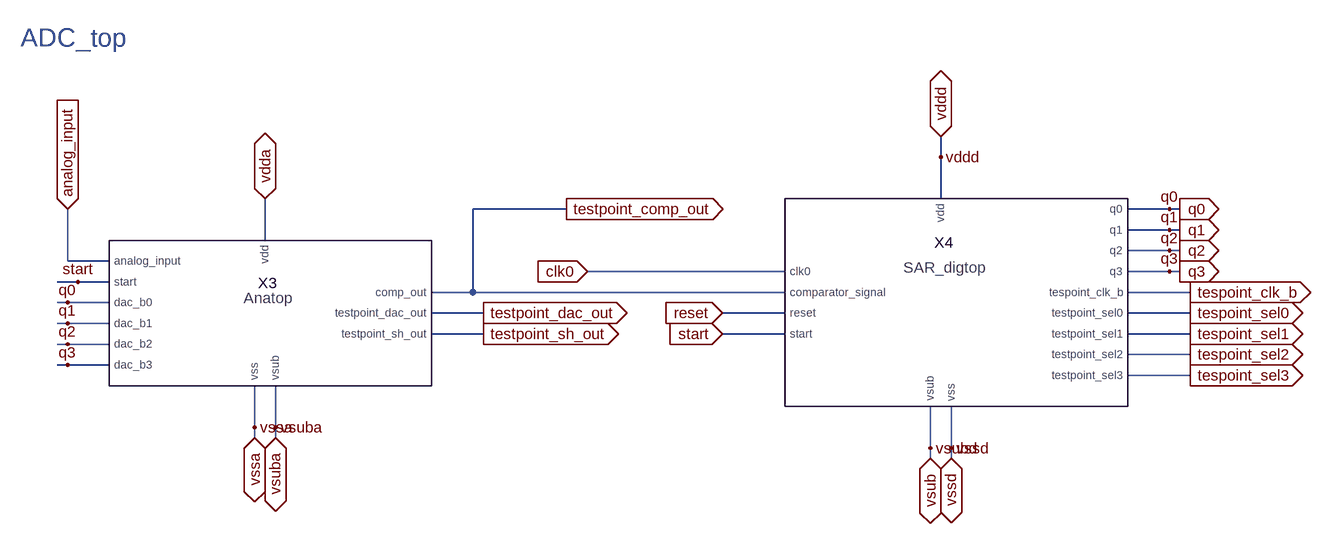
[diagram p0: schematic dsproj_adctop.asc]
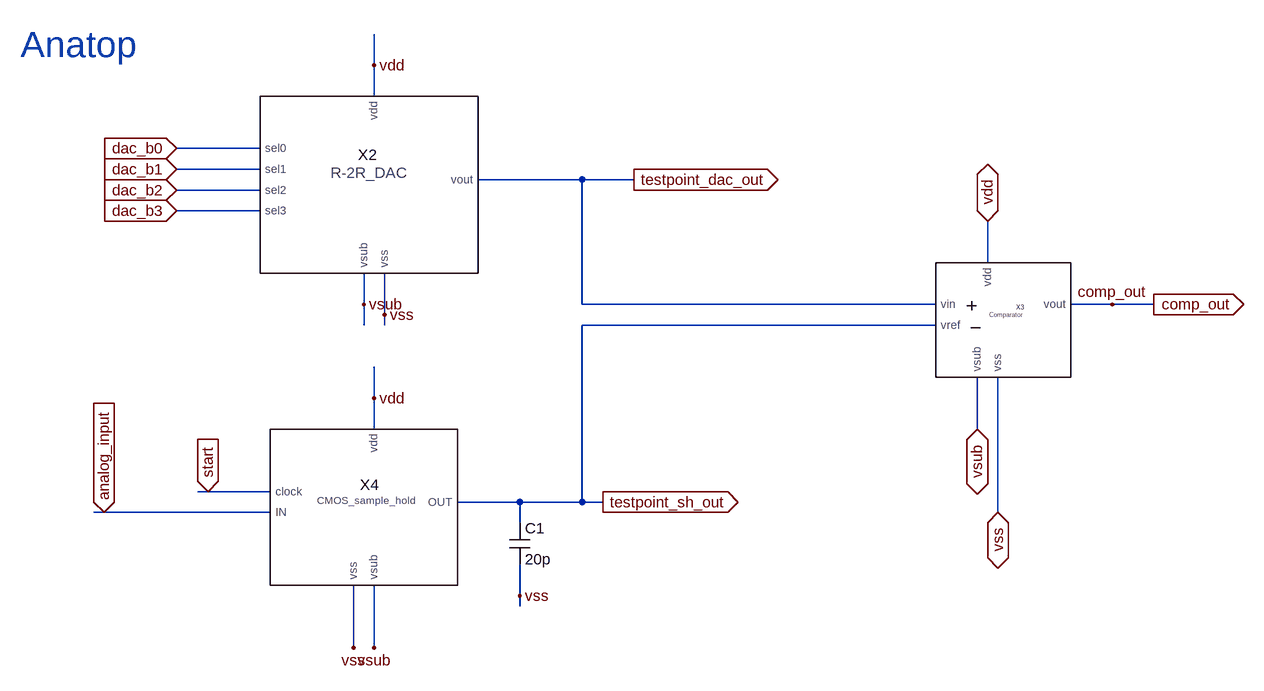
[diagram p1: sub-circuit dsproj_anatop.asc]
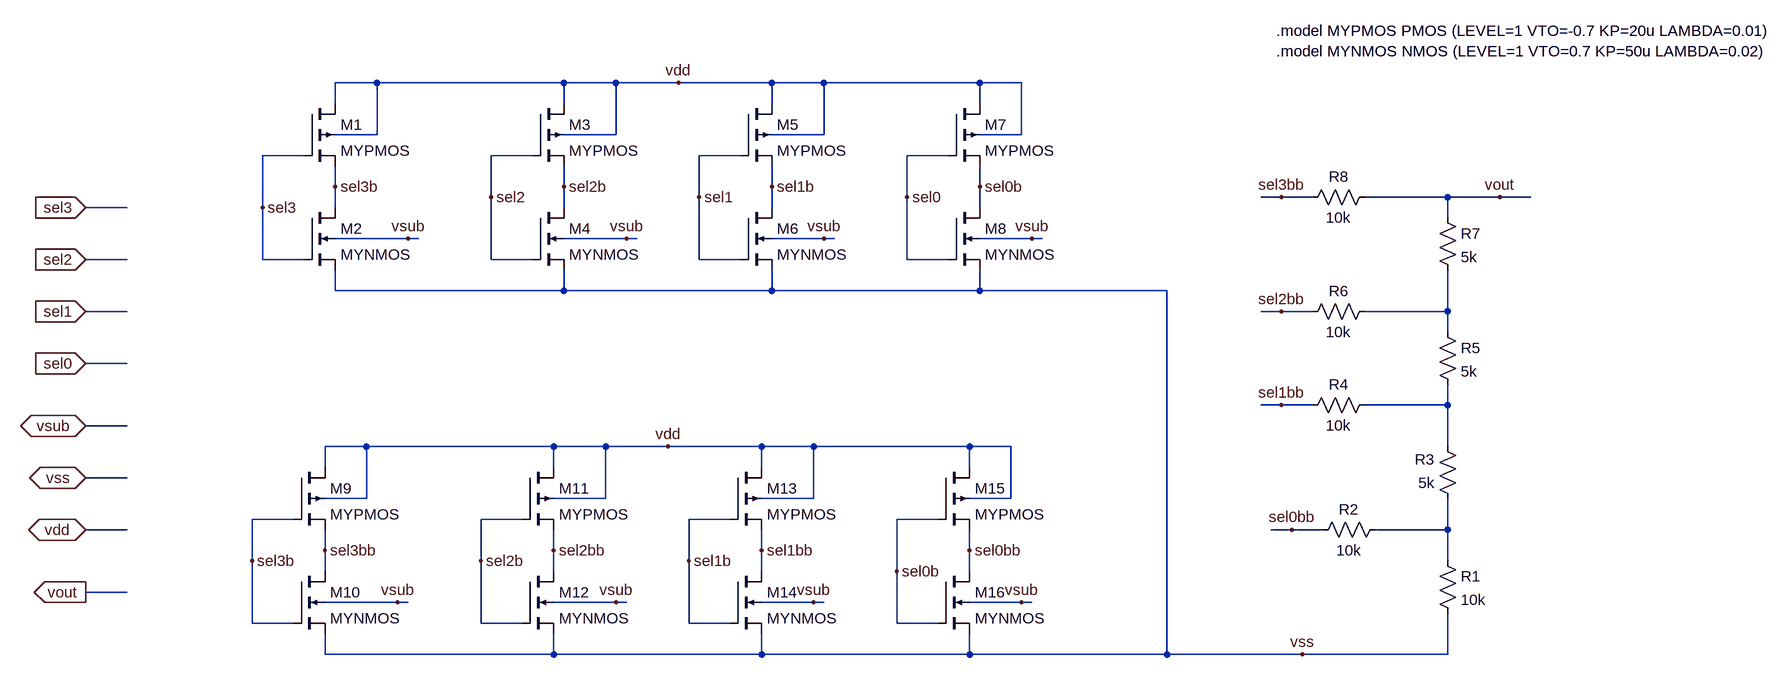
[diagram p2: sub-circuit dsproj_r2rdac.asc]
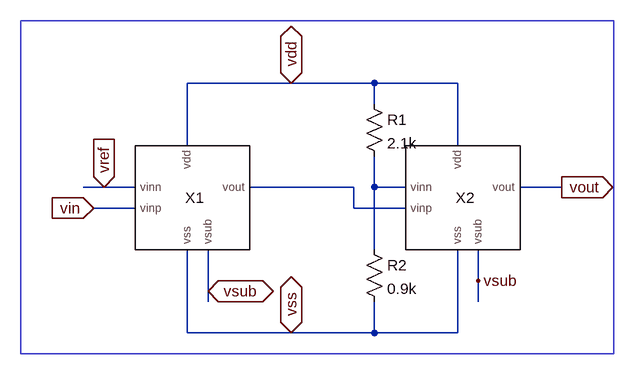
[diagram p3: sub-circuit dsproj_twostagecomparator.asc]
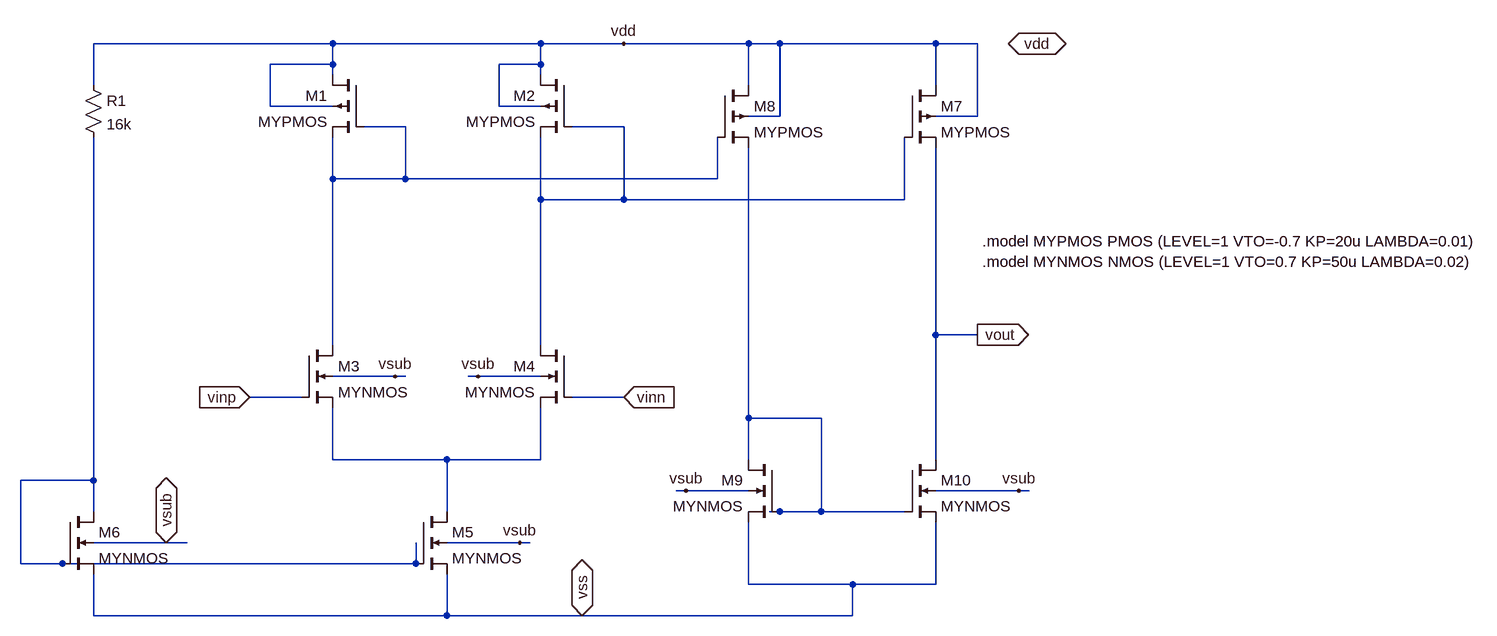
[diagram p4: sub-circuit dsproj_nmos_comparator.asc]
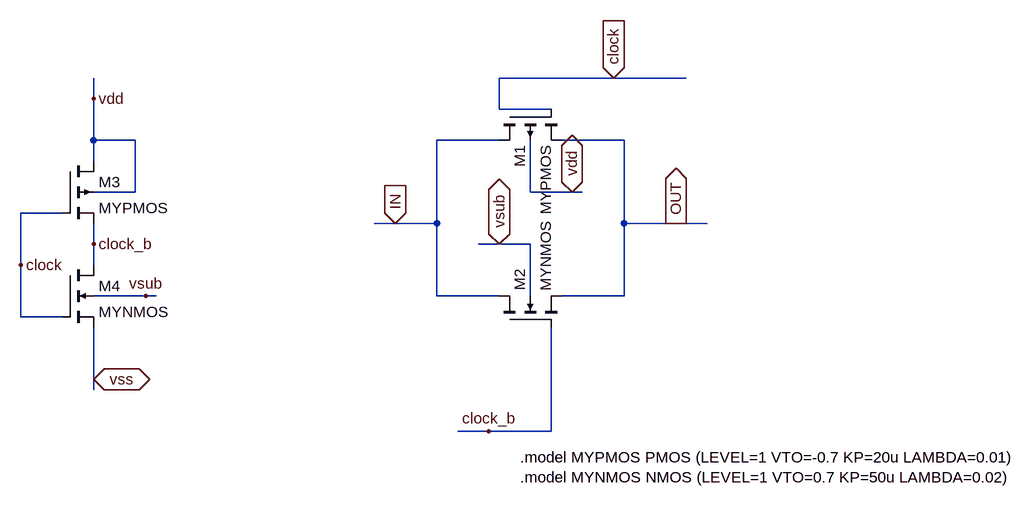
[diagram p5: sub-circuit dsproj_cmossampleandhold.asc]
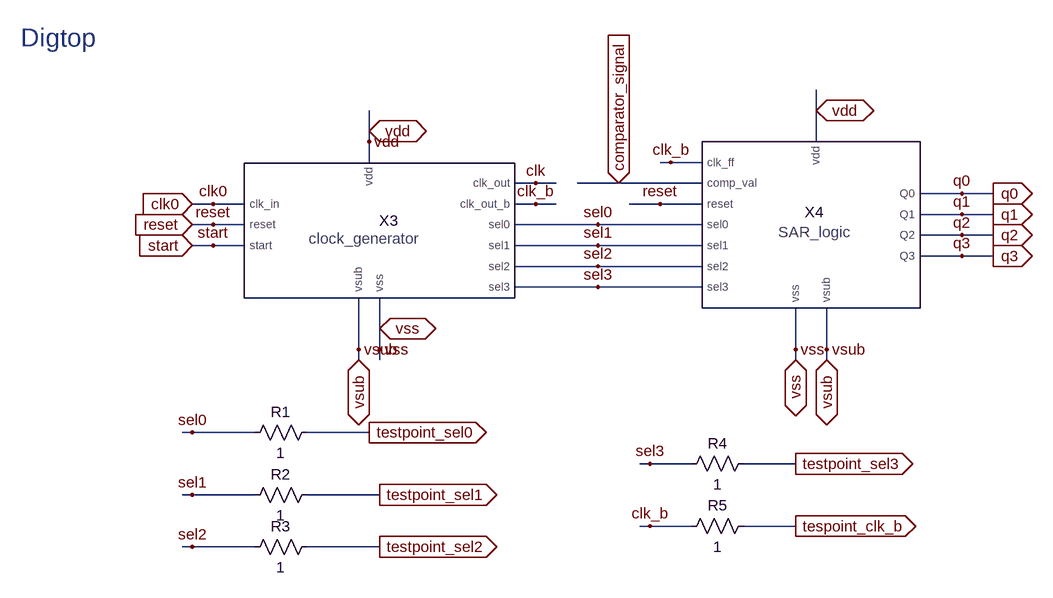
[diagram p6: sub-circuit dsproj_digtop.asc]
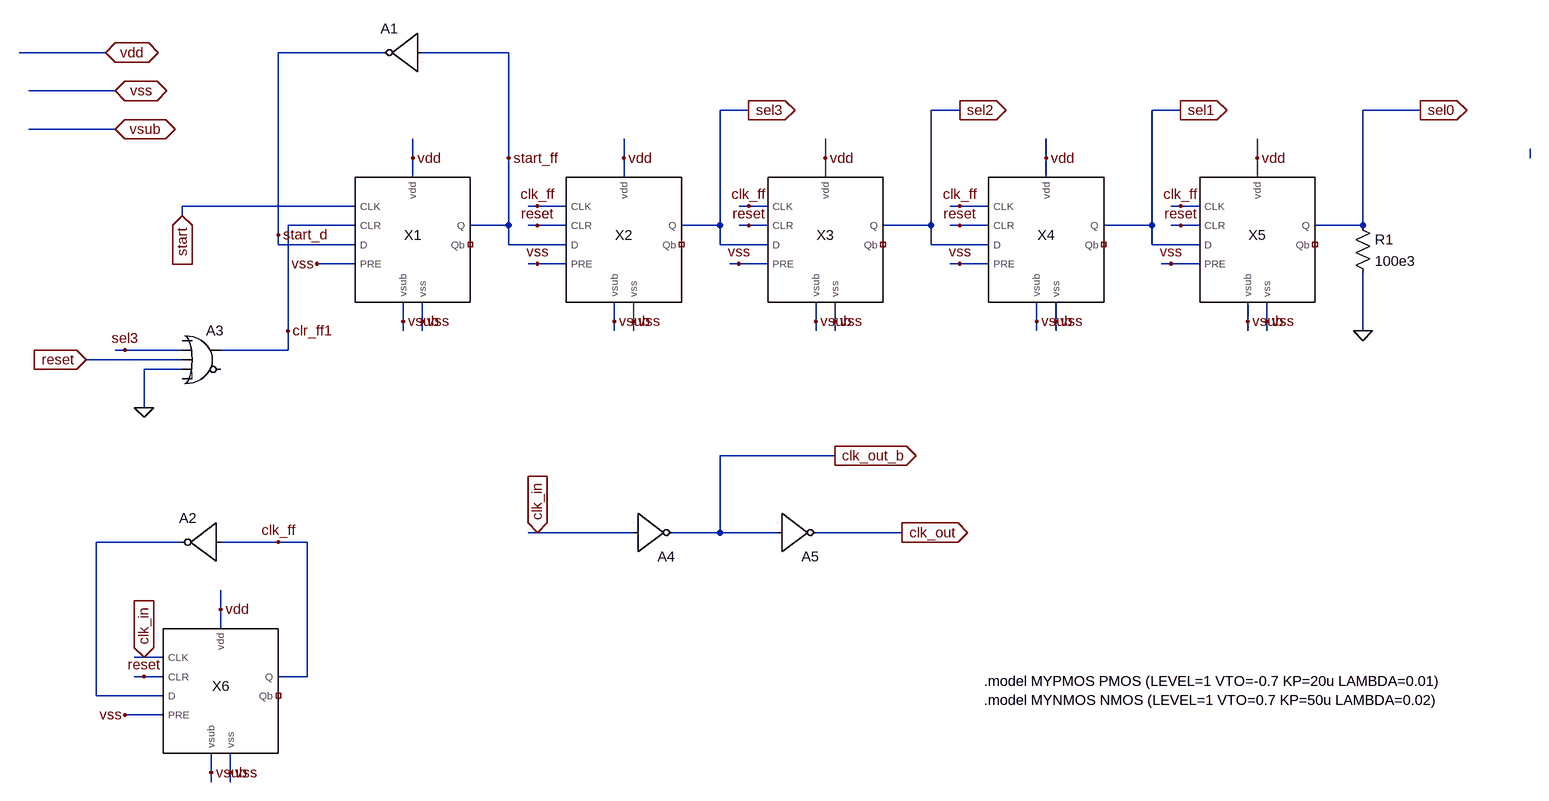
[diagram p7: sub-circuit dsproj_clkgenerator.asc]
dsproj_adctop.asc, the LTspice schematic file:
Version 4.1
SHEET 1 2052 900
WIRE 624 -208 624 -240
WIRE 624 -144 624 -208
WIRE 48 -128 -96 -128
WIRE 976 -128 912 -128
WIRE 992 -128 976 -128
WIRE 976 -96 912 -96
WIRE 992 -96 976 -96
WIRE -416 -80 -416 -144
WIRE 976 -64 912 -64
WIRE 992 -64 976 -64
WIRE -720 -48 -720 -128
WIRE -656 -48 -720 -48
WIRE 384 -32 80 -32
WIRE 976 -32 912 -32
WIRE 992 -32 976 -32
WIRE -704 -16 -736 -16
WIRE -656 -16 -704 -16
WIRE -96 0 -96 -128
WIRE -96 0 -160 0
WIRE 384 0 -96 0
WIRE 1008 0 912 0
WIRE -720 16 -736 16
WIRE -656 16 -720 16
WIRE -80 32 -160 32
WIRE 384 32 288 32
WIRE 1008 32 912 32
WIRE -720 48 -736 48
WIRE -656 48 -720 48
WIRE -80 64 -160 64
WIRE 384 64 288 64
WIRE 1008 64 912 64
WIRE -720 80 -736 80
WIRE -656 80 -720 80
WIRE 1008 96 912 96
WIRE -720 112 -736 112
WIRE -656 112 -720 112
WIRE 1008 128 912 128
WIRE -432 208 -432 144
WIRE -400 208 -400 144
WIRE -432 224 -432 208
WIRE -400 224 -400 208
WIRE 608 240 608 176
WIRE 640 240 640 176
WIRE 608 256 608 240
WIRE 640 256 640 240
FLAG -432 208 vssa
FLAG -400 208 vsuba
FLAG 624 -208 vddd
FLAG 608 240 vsubd
FLAG 640 240 vssd
FLAG -720 16 q0
FLAG -720 48 q1
FLAG -720 80 q2
FLAG -720 112 q3
FLAG 976 -128 q0
FLAG 976 -96 q1
FLAG 976 -64 q2
FLAG 976 -32 q3
FLAG -416 -144 vdda
IOPIN -416 -144 BiDir
FLAG -400 224 vsuba
IOPIN -400 224 BiDir
FLAG -432 224 vssa
IOPIN -432 224 BiDir
FLAG 624 -240 vddd
IOPIN 624 -240 BiDir
FLAG 608 256 vsub
IOPIN 608 256 BiDir
FLAG 640 256 vssd
IOPIN 640 256 BiDir
FLAG 1008 0 tespoint_clk_b
IOPIN 1008 0 Out
FLAG 1008 32 tespoint_sel0
IOPIN 1008 32 Out
FLAG 1008 64 tespoint_sel1
IOPIN 1008 64 Out
FLAG 1008 96 tespoint_sel2
IOPIN 1008 96 Out
FLAG 1008 128 tespoint_sel3
IOPIN 1008 128 Out
FLAG 80 -32 clk0
IOPIN 80 -32 In
FLAG -80 32 testpoint_dac_out
IOPIN -80 32 Out
FLAG -80 64 testpoint_sh_out
IOPIN -80 64 Out
FLAG 288 32 reset
IOPIN 288 32 In
FLAG 288 64 start
IOPIN 288 64 In
FLAG -704 -16 start
FLAG -720 -128 analog_input
IOPIN -720 -128 In
FLAG 992 -128 q0
IOPIN 992 -128 Out
FLAG 992 -96 q1
IOPIN 992 -96 Out
FLAG 992 -64 q2
IOPIN 992 -64 Out
FLAG 992 -32 q3
IOPIN 992 -32 Out
FLAG 48 -128 testpoint_comp_out
IOPIN 48 -128 Out
SYMBOL dsproj_anatop -416 32 R0
SYMATTR InstName X3
SYMBOL dsproj_digtop 640 32 R0
SYMATTR InstName X4
TEXT -792 -392 Left 4 ;ADC_top

The netlist it stands for:
* dsproj_adctop.asc
X§X3 analog_input q0 q1 q2 q3 testpoint_comp_out testpoint_dac_out testpoint_sh_out vdda vssa vsuba start dsproj_anatop
X§X4 clk0 testpoint_comp_out reset start q0 q1 q2 q3 tespoint_clk_b tespoint_sel0 tespoint_sel1 tespoint_sel2 tespoint_sel3 vddd vssd vsub dsproj_digtop

* block symbol definitions
.subckt dsproj_anatop analog_input dac_b0 dac_b1 dac_b2 dac_b3 comp_out testpoint_dac_out testpoint_sh_out vdd vss vsub start
X§X2 dac_b0 dac_b1 dac_b2 dac_b3 vdd testpoint_dac_out vss vsub dsproj_r2rdac
X§X3 testpoint_dac_out testpoint_sh_out vdd comp_out vss vsub dsproj_twostagecomparator
C1 testpoint_sh_out vss 20p
X§X4 analog_input start testpoint_sh_out vdd vsub vss dsproj_cmossampleandhold
* Anatop
.ends dsproj_anatop

.subckt dsproj_r2rdac sel0 sel1 sel2 sel3 vdd vout vss vsub
M1 vdd sel3 sel3b vdd MYPMOS l=180e-9 w=2.4e-6
M2 sel3b sel3 vss vsub MYNMOS l=180e-9 w=1.2e-6
M3 vdd sel2 sel2b vdd MYPMOS l=180e-9 w=2.4e-6 m=1
M4 sel2b sel2 vss vsub MYNMOS l=180e-9 w=1.2e-6 m=1
M5 vdd sel1 sel1b vdd MYPMOS l=180e-9 w=2.4e-6 m=1
M6 sel1b sel1 vss vsub MYNMOS l=180e-9 w=1.2e-6 m=1
M7 vdd sel0 sel0b vdd MYPMOS l=180e-9 w=2.4e-6 m=1
M8 sel0b sel0 vss vsub MYNMOS l=180e-9 w=1.2e-6 m=1
M9 vdd sel3b sel3bb vdd MYPMOS l=180e-9 w=2.4e-6 m=1
M10 sel3bb sel3b vss vsub MYNMOS l=180e-9 w=1.2e-6 m=1
M11 vdd sel2b sel2bb vdd MYPMOS l=180e-9 w=2.4e-6 m=1
M12 sel2bb sel2b vss vsub MYNMOS l=180e-9 w=1.2e-6 m=1
M13 vdd sel1b sel1bb vdd MYPMOS l=180e-9 w=2.4e-6 m=1
M14 sel1bb sel1b vss vsub MYNMOS l=180e-9 w=1.2e-6 m=1
M15 vdd sel0b sel0bb vdd MYPMOS l=180e-9 w=2.4e-6 m=1
M16 sel0bb sel0b vss vsub MYNMOS l=180e-9 w=1.2e-6 m=1
R1 N003 vss 10k
R2 N003 sel0bb 10k
R3 N003 N002 5k
R4 sel1bb N002 10k
R5 N001 N002 5k
R6 N001 sel2bb 10k
R7 vout N001 5k
R8 vout sel3bb 10k
.model MYPMOS PMOS (LEVEL=1 VTO=-0.7 KP=20u LAMBDA=0.01)
.model MYNMOS NMOS (LEVEL=1 VTO=0.7 KP=50u LAMBDA=0.02)
.ends dsproj_r2rdac

.subckt dsproj_twostagecomparator vin vref vdd vout vss vsub
XX1 vref vin vdd N001 vss vsub dsproj_nmos_comparator
XX2 N002 N001 vdd vout vss vsub dsproj_nmos_comparator
R1 vdd N002 2.1k
R2 N002 vss 0.9k
.ends dsproj_twostagecomparator

.subckt dsproj_nmos_comparator vinn vinp vdd vout vss vsub
M1 vdd N001 N001 vdd MYPMOS l=180e-9 w=1.2e-6 m=2
M2 vdd N002 N002 vdd MYPMOS l=180e-9 w=1.2e-6 m=2
M4 N002 vinn N004 vsub MYNMOS l=180e-9 w=1.2e-6 m=3
M5 N004 N005 vss vsub MYNMOS l=3e-6 w=10e-6 m=2
R1 vdd N005 16k
M6 N005 N005 vss vsub MYNMOS l=3e-6 w=10e-6 m=2
M3 N001 vinp N004 vsub MYNMOS l=180e-9 w=1.2e-6 m=3
M7 vdd N002 vout vdd MYPMOS l=180e-9 w=1.2e-6 m=2
M8 vdd N001 N003 vdd MYPMOS l=180e-9 w=1.2e-6 m=2
M9 N003 N003 vss vsub MYNMOS l=180e-9 w=1.2e-6 m=1
M10 vout N003 vss vsub MYNMOS l=180e-9 w=1.2e-6 m=1
.model MYPMOS PMOS (LEVEL=1 VTO=-0.7 KP=20u LAMBDA=0.01)
.model MYNMOS NMOS (LEVEL=1 VTO=0.7 KP=50u LAMBDA=0.02)
.ends dsproj_nmos_comparator

.subckt dsproj_cmossampleandhold IN clock OUT vdd vsub vss
M1 IN clock OUT vdd MYPMOS l=180e-9 w=2400e-9
M2 IN clock_b OUT vsub MYNMOS l=180e-9 w=1200e-9
M3 vdd clock clock_b vdd MYPMOS l=180e-9 w=2.4e-6 m=1
M4 clock_b clock vss vsub MYNMOS l=180e-9 w=1.2e-6 m=1
.model MYPMOS PMOS (LEVEL=1 VTO=-0.7 KP=20u LAMBDA=0.01)
.model MYNMOS NMOS (LEVEL=1 VTO=0.7 KP=50u LAMBDA=0.02)
.ends dsproj_cmossampleandhold

.subckt dsproj_digtop clk0 comparator_signal reset start q0 q1 q2 q3 tespoint_clk_b testpoint_sel0 testpoint_sel1 testpoint_sel2 testpoint_sel3 vdd vss vsub
R1 testpoint_sel0 sel0 1
R2 testpoint_sel1 sel1 1
R3 testpoint_sel2 sel2 1
R4 testpoint_sel3 sel3 1
R5 tespoint_clk_b clk_b 1
X§X3 clk0 reset start clk clk_b sel0 sel1 sel2 sel3 vdd vss vsub dsproj_clkgenerator
X§X4 clk_b comparator_signal reset sel0 sel1 sel2 sel3 q0 q1 q2 q3 vsub vss vdd dsproj_sarlogicblock
* Digtop
.ends dsproj_digtop

.subckt dsproj_clkgenerator clk_in reset start clk_out clk_out_b sel0 sel1 sel2 sel3 vdd vss vsub
X§X1 start clr_ff1 start_d vss start_ff NC_01 vdd vss vsub dsproj_dff
X§X2 clk_ff reset start_ff vss sel3 NC_02 vdd vss vsub dsproj_dff
X§X3 clk_ff reset sel3 vss sel2 NC_03 vdd vss vsub dsproj_dff
X§X4 clk_ff reset sel2 vss sel1 NC_04 vdd vss vsub dsproj_dff
X§X5 clk_ff reset sel1 vss sel0 NC_05 vdd vss vsub dsproj_dff
X§X6 clk_in reset N002 vss clk_ff NC_06 vdd vss vsub dsproj_dff
R1 sel0 0 100e3
A1 start_ff 0 0 0 0 start_d 0 0 BUF
A2 clk_ff 0 0 0 0 N002 0 0 BUF
A3 0 sel3 reset 0 0 0 clr_ff1 0 OR
A4 clk_in 0 0 0 0 clk_out_b 0 0 BUF
A5 clk_out_b 0 0 0 0 clk_out 0 0 BUF
.model MYPMOS PMOS (LEVEL=1 VTO=-0.7 KP=20u LAMBDA=0.01)
.model MYNMOS NMOS (LEVEL=1 VTO=0.7 KP=50u LAMBDA=0.02)
.ends dsproj_clkgenerator

.subckt dsproj_dff CLK CLR D PRE Q Qb vdd vss vsub
A1 N004 0 N005 PRE N010 N006 N001 0 DFLOP
M1 vdd N003 N004 vdd MYPMOS l=180e-9 w=2400e-9
M2 N004 N003 vss vsub MYNMOS l=180e-9 w=1200e-9
M3 vdd D N003 vdd MYPMOS l=180e-9 w=2400e-9
M4 N003 D vss vsub MYNMOS l=180e-9 w=1200e-9
M5 vdd N007 N005 vdd MYPMOS l=180e-9 w=2400e-9
M6 N005 N007 vss vsub MYNMOS l=180e-9 w=1200e-9
M7 vdd CLK N007 vdd MYPMOS l=180e-9 w=2400e-9
M8 N007 CLK vss vsub MYNMOS l=180e-9 w=1200e-9
M9 vdd N002 Q vdd MYPMOS l=180e-9 w=2400e-9
M10 Q N002 vss vsub MYNMOS l=180e-9 w=1200e-9
M11 vdd N001 N002 vdd MYPMOS l=180e-9 w=2400e-9
M12 N002 N001 vss vsub MYNMOS l=180e-9 w=1200e-9
M13 vdd N008 Qb vdd MYPMOS l=180e-9 w=2400e-9
M14 Qb N008 vss vsub MYNMOS l=180e-9 w=1200e-9
M15 vdd N006 N008 vdd MYPMOS l=180e-9 w=2400e-9
M16 N008 N006 vss vsub MYNMOS l=180e-9 w=1200e-9
M17 vdd N009 N010 vdd MYPMOS l=180e-9 w=2400e-9
M18 N010 N009 vss vsub MYNMOS l=180e-9 w=1200e-9
M19 vdd CLR N009 vdd MYPMOS l=180e-9 w=2400e-9
M20 N009 CLR vss vsub MYNMOS l=180e-9 w=1200e-9
.tran 200
.model MYPMOS PMOS (LEVEL=1 VTO=-0.7 KP=20u LAMBDA=0.01)
.model MYNMOS NMOS (LEVEL=1 VTO=0.7 KP=50u LAMBDA=0.02)
.ends dsproj_dff

.subckt dsproj_sarlogicblock clk_ff comp_val reset sel0 sel1 sel2 sel3 Q0 Q1 Q2 Q3 vsub vss vdd
X§X1 comp_val N001 sel0 vsub N002 vdd vss dsproj_2to1mux
X§X2 clk_ff_0 reset N002 vss Q0 NC_01 vdd vss vsub dsproj_dff
A1 Q0 0 0 0 0 N001 0 0 BUF
X§X3 comp_val N003 sel1 vsub N004 vdd vss dsproj_2to1mux
X§X4 clk_ff_1 reset N004 vss Q1 NC_02 vdd vss vsub dsproj_dff
A2 Q1 0 0 0 0 N003 0 0 BUF
X§X5 comp_val N005 sel2 vsub N006 vdd vss dsproj_2to1mux
X§X6 clk_ff_2 reset N006 vss Q2 NC_03 vdd vss vsub dsproj_dff
A3 Q2 0 0 0 0 N005 0 0 BUF
X§X7 comp_val N007 sel3 vsub N008 vdd vss dsproj_2to1mux
X§X8 clk_ff_3 reset N008 vss Q3 NC_04 vdd vss vsub dsproj_dff
A4 Q3 0 0 0 0 N007 0 0 BUF
A5 0 sel0 clk_ff vdd 0 0 clk_ff_0 0 AND
A6 0 sel1 clk_ff vdd 0 0 clk_ff_1 0 AND
A7 0 sel2 clk_ff vdd 0 0 clk_ff_2 0 AND
A8 0 sel3 clk_ff vdd 0 0 clk_ff_3 0 AND
.model MYPMOS PMOS (LEVEL=1 VTO=-0.7 KP=20u LAMBDA=0.01)
.model MYNMOS NMOS (LEVEL=1 VTO=0.7 KP=50u LAMBDA=0.02)
.ends dsproj_sarlogicblock

.subckt dsproj_2to1mux A B sela vsub out vdd vss
M1 vdd sela_b sela_bb vdd MYPMOS l=180e-9 w=2400e-9
M2 sela_bb sela_b vss vsub MYNMOS l=180e-9 w=1200e-9
M3 vdd sela sela_b vdd MYPMOS l=180e-9 w=2400e-9
M4 sela_b sela vss vsub MYNMOS l=180e-9 w=1200e-9
M5 N002 B out vdd MYPMOS l=180e-9 w=2400e-9
M6 out B N003 vsub MYNMOS l=180e-9 w=1200e-9
M7 N001 A out vdd MYPMOS l=180e-9 w=2400e-9
M8 out A N004 vsub MYNMOS l=180e-9 w=1200e-9
M9 vdd sela_b N001 vdd MYPMOS l=180e-9 w=2400e-9
M10 N004 sela_bb vss vsub MYNMOS l=180e-9 w=1200e-9
M11 vdd sela_bb N002 vdd MYPMOS l=180e-9 w=2400e-9
M12 N003 sela_b vss vsub MYNMOS l=180e-9 w=1200e-9
* 2-to-1-Mux
.model MYPMOS PMOS (LEVEL=1 VTO=-0.7 KP=20u LAMBDA=0.01)
.model MYNMOS NMOS (LEVEL=1 VTO=0.7 KP=50u LAMBDA=0.02)
.ends dsproj_2to1mux

.model NMOS NMOS
.model PMOS PMOS
.lib standard.mos
* ADC_top
.backanno
.end